# EAGLE schematic M7106C (EAGLE 6.6.0)

## Sheet 1 of 4
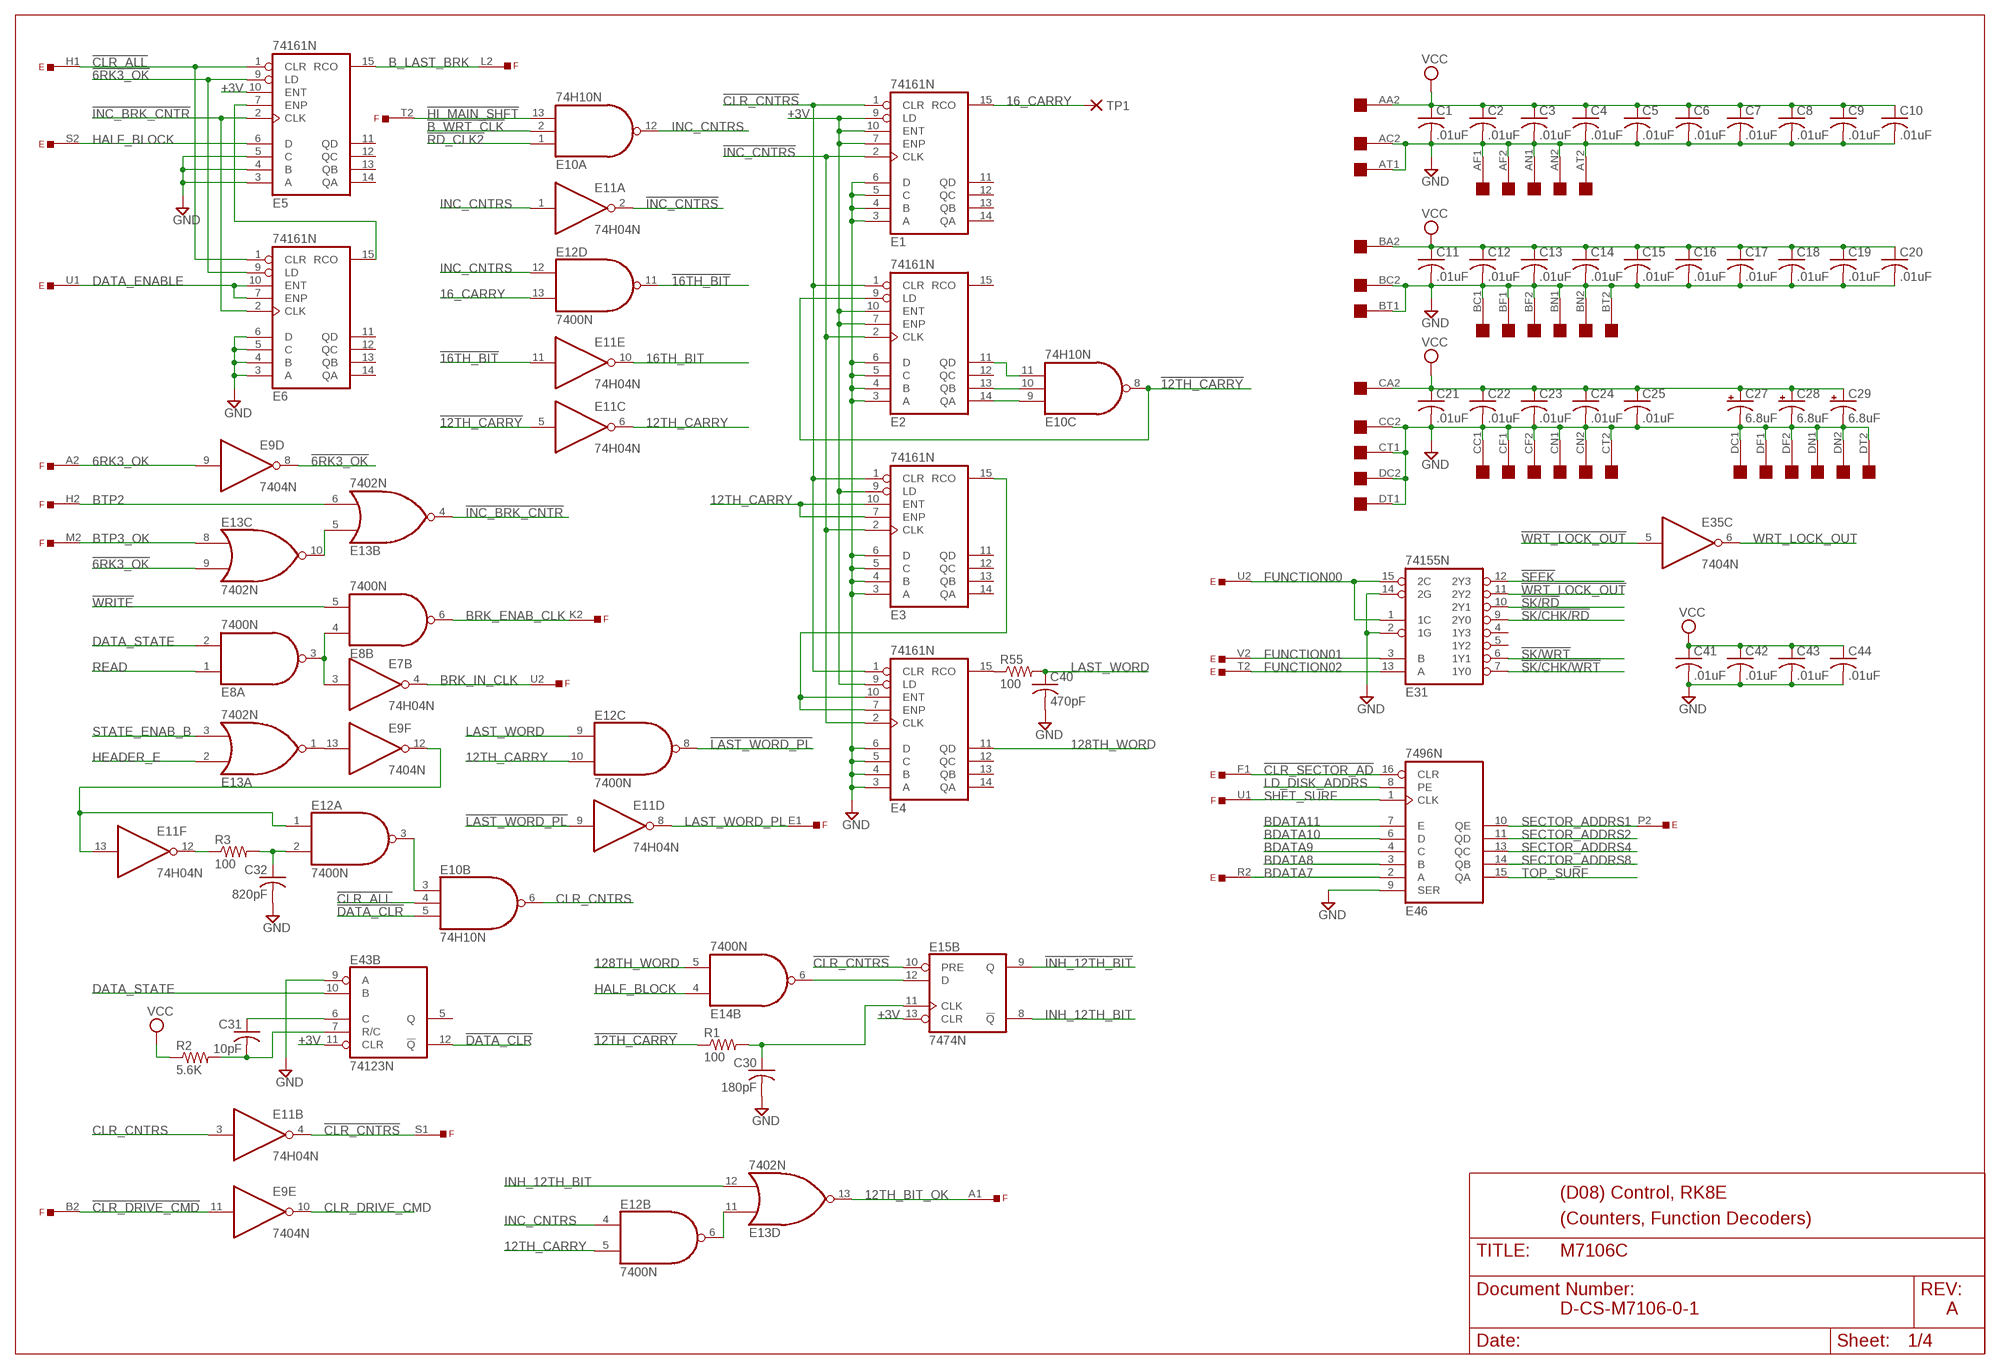
[diagram p0: schematic, sheet 1]

### Parts
C1  .01uF  C-US  [C063-025X075]
C2  .01uF  C-US  [C063-025X075]
C3  .01uF  C-US  [C063-025X075]
C4  .01uF  C-US  [C063-025X075]
C5  .01uF  C-US  [C063-025X075]
C6  .01uF  C-US  [C063-025X075]
C7  .01uF  C-US  [C063-025X075]
C8  .01uF  C-US  [C063-025X075]
C9  .01uF  C-US  [C063-025X075]
C10  .01uF  C-US  [C063-025X075]
C11  .01uF  C-US  [C063-025X075]
C12  .01uF  C-US  [C063-025X075]
C13  .01uF  C-US  [C063-025X075]
C14  .01uF  C-US  [C063-025X075]
C15  .01uF  C-US  [C063-025X075]
C16  .01uF  C-US  [C063-025X075]
C17  .01uF  C-US  [C063-025X075]
C18  .01uF  C-US  [C063-025X075]
C19  .01uF  C-US  [C063-025X075]
C20  .01uF  C-US  [C063-025X075]
C21  .01uF  C-US  [C063-025X075]
C22  .01uF  C-US  [C063-025X075]
C23  .01uF  C-US  [C063-025X075]
C24  .01uF  C-US  [C063-025X075]
C25  .01uF  C-US  [C063-025X075]
C27  6.8uF  CPOL-USE20-8AXIAL  [E12-8]
C28  6.8uF  CPOL-USE20-8AXIAL  [E12-8]
C29  6.8uF  CPOL-USE20-8AXIAL  [E12-8]
C30  180pF  C-US  [C063-025X075]
C31  10pF  C-US  [C063-025X075]
C32  820pF  C-US  [C063-025X075]
C40  470pF  C-US  [C063-025X075]
C41  .01uF  C-US  [C063-025X075]
C42  .01uF  C-US  [C063-025X075]
C43  .01uF  C-US  [C063-025X075]
C44  .01uF  C-US  [C063-025X075]
E  EDGE-TOP  [EDGE-CON2]
E1  74161N  [DIL16]
E2  74161N  [DIL16]
E3  74161N  [DIL16]
E4  74161N  [DIL16]
E5  74161N  [DIL16]
E6  74161N  [DIL16]
E7  74H04N  7404N  [DIL14]
E8  7400N  [DIL14]
E9  7404N  [DIL14]
E10  74H10N  7410N  [DIL14]
E11  74H04N  7404N  [DIL14]
E12  7400N  [DIL14]
E13  7402N  [DIL14]
E14  7400N  [DIL14]
E15  7474N  74S74N  [DIL14]
E31  74155N  [DIL16]
E35  7404N  [DIL14]
E43  74123N  [DIL16]
E46  7496N  74LS96N  [DIL16]
F  EDGE-TOP  [EDGE-CON2]
OMNIBUS  QUAD  [EDGE-CON8]
R1  100  R-US_0207/10  [0207/10]
R2  5.6K  R-US_0207/10  [0207/10]
R3  100  R-US_0207/10  [0207/10]
R55  100  R-US_0207/10  [0207/10]
TP1  PAD-0420  [0420]

### Nets
6RK3_OK: E9.9(D:I) F.A2 ; also sheet 3,4
12TH_BIT_OK: E13.13(D:O) F.A1
12TH_CARRY: E3.7(ENP) E3.10(ENT) E11.6(C:O) E12.5(B:I1) E12.10(C:I1)
16_CARRY: E1.15(RCO) E12.13(D:I1) TP1.P$1(P)
16TH_BIT: E11.10(E:O) ; also sheet 3
128TH_WORD: E4.11(QD) E14.5(B:I1)
!6RK3_OK: E5.9(LD) E6.9(LD) E9.8(D:O) E13.9(C:I1)
!12TH_CARRY: E2.9(LD) E10.8(C:O) E11.5(C:I) R1.1
!16TH_BIT: E11.11(E:I) E12.11(D:O) ; also sheet 3
!B_WRT_CLK: E10.2(A:I1) ; also sheet 2
!CLR_ALL: E5.1(CLR) E6.1(CLR) E10.4(B:I1) E.H1 ; also sheet 2,3
!CLR_CNTRS: E1.1(CLR) E2.1(CLR) E3.1(CLR) E4.1(CLR) E11.4(B:O) E15.10(B:PRE) F.S1
!CLR_DRIVE_CMD: E9.11(E:I) F.B2 ; also sheet 3
!CLR_SECTOR_AD: E46.16(CLR) E.F1
!DATA_CLR: E10.5(B:I2) E43.12(B:!Q)
!HI_MAIN_SHFT: E10.13(A:I2) F.T2
!INC_BRK_CNTR: E5.2(CLK) E6.2(CLK) E13.4(B:O)
!INC_CNTRS: E1.2(CLK) E2.2(CLK) E3.2(CLK) E4.2(CLK) E11.2(A:O)
!INH_12TH_BIT: E15.9(B:Q) ; also sheet 2
!LAST_WORD_PL: E11.9(D:I) E12.8(C:O) ; also sheet 3
!RD_CLK2: E10.1(A:I0) ; also sheet 2
!SEEK: E31.12(2Y3) ; also sheet 3
!SK/CHK/RD: E31.9(2Y0) ; also sheet 3
!SK/CHK/WRT: E31.7(1Y0) ; also sheet 2,3
!SK/RD: E31.10(2Y1) ; also sheet 3
!SK/WRT: E31.6(1Y1) ; also sheet 2,3
!WRITE: E8.5(B:I1) ; also sheet 2
!WRT_LOCK_OUT: E31.11(2Y2) E35.5(C:I) ; also sheet 3
+3V: E1.7(ENP) E1.9(LD) E1.10(ENT) E2.7(ENP) E2.10(ENT) E3.9(LD) E4.9(LD) E5.10(ENT) E15.13(B:CLR) E43.11(B:CLR) ; also sheet 2,3,4
B_LAST_BRK: E5.15(RCO) F.L2
BDATA7: E46.2(A) E.R2
BDATA8: E46.3(B) ; also sheet 4
BDATA9: E46.4(C) ; also sheet 4
BDATA10: E46.6(D) ; also sheet 4
BDATA11: E46.7(E) ; also sheet 4
BRK_ENAB_CLK: E8.6(B:O) F.K2
BRK_IN_CLK: E7.4(B:O) F.U2
BTP2: E13.6(B:I1) F.H2
BTP3_OK: E13.8(C:I0) F.M2
CLR_CNTRS: E10.6(B:O) E11.3(B:I)
CLR_DRIVE_CMD: E9.10(E:O) ; also sheet 3
DATA_ENABLE: E6.7(ENP) E6.10(ENT) E.U1
DATA_STATE: E8.2(A:I1) E43.10(B:B) ; also sheet 2,3
FUNCTION00: E31.1(1C) E31.15(2C) E.U2
FUNCTION01: E31.3(B) E.V2
FUNCTION02: E31.13(A) E.T2
GND [supply]: C1.2 C2.2 C3.2 C4.2 C5.2 C6.2 C7.2 C8.2 C9.2 C10.2 C11.2 C12.2 C13.2 C14.2 C15.2 C16.2 C17.2 C18.2 C19.2 C20.2 C21.2 C22.2 C23.2 C24.2 C25.2 C27.- C28.- C29.- C30.2 C32.2 C40.2 C41.2 C42.2 C43.2 C44.2 E1.3(A) E1.4(B) E1.5(C) E1.6(D) E2.3(A) E2.4(B) E2.5(C) E2.6(D) E3.3(A) E3.4(B) E3.5(C) E3.6(D) E4.3(A) E4.4(B) E4.5(C) E4.6(D) E5.3(A) E5.4(B) E5.5(C) E6.3(A) E6.4(B) E6.5(C) E6.6(D) E31.2(1G) E31.14(2G) E43.9(B:A) E46.9(SER) OMNIBUS.AC2 OMNIBUS.AF1 OMNIBUS.AF2 OMNIBUS.AN1 OMNIBUS.AN2 OMNIBUS.AT1 OMNIBUS.AT2 OMNIBUS.BC1 OMNIBUS.BC2 OMNIBUS.BF1 OMNIBUS.BF2 OMNIBUS.BN1 OMNIBUS.BN2 OMNIBUS.BT1 OMNIBUS.BT2 OMNIBUS.CC1 OMNIBUS.CC2 OMNIBUS.CF1 OMNIBUS.CF2 OMNIBUS.CN1 OMNIBUS.CN2 OMNIBUS.CT1 OMNIBUS.CT2 OMNIBUS.DC1 OMNIBUS.DC2 OMNIBUS.DF1 OMNIBUS.DF2 OMNIBUS.DN1 OMNIBUS.DN2 OMNIBUS.DT1 OMNIBUS.DT2 ; also sheet 2,3,4
HALF_BLOCK: E5.6(D) E14.4(B:I0) E.S2
HEADER_E: E13.2(A:I0) ; also sheet 3
INC_CNTRS: E10.12(A:O) E11.1(A:I) E12.4(B:I0) E12.12(D:I0)
INH_12TH_BIT: E13.12(D:I1) E15.8(B:!Q)
LAST_WORD: C40.1 E12.9(C:I0) R55.2
LAST_WORD_PL: E11.8(D:O) F.E1
LD_DISK_ADDRS: E46.8(PE) ; also sheet 3
N$1: E5.7(ENP) E6.15(RCO)
N$2: E9.13(F:I) E13.1(A:O)
N$3: E13.5(B:I0) E13.10(C:O)
N$4: E7.3(B:I) E8.3(A:O) E8.4(B:I0)
N$5: E9.12(F:O) E11.13(F:I) E12.1(A:I0)
N$6: E11.12(F:O) R3.1
N$7: C32.1 E12.2(A:I1) R3.2
N$8: C31.2 E43.7(B:R/C) R2.2
N$9: C31.1 E43.6(B:C)
N$10: E10.3(B:I0) E12.3(A:O)
N$11: E2.14(QA) E10.9(C:I0)
N$13: E2.13(QB) E10.10(C:I1)
N$14: E2.11(QD) E10.11(C:I2)
N$15: E3.15(RCO) E4.7(ENP) E4.10(ENT)
N$16: E4.15(RCO) R55.1
N$17: E14.6(B:O) E15.12(B:D)
N$18: C30.1 E15.11(B:CLK) R1.2
N$19: E12.6(B:O) E13.11(D:I0)
READ: E8.1(A:I0) ; also sheet 2,4
SECTOR_ADDRS1: E46.10(QE) E.P2 ; also sheet 4
SECTOR_ADDRS2: E46.11(QD) ; also sheet 4
SECTOR_ADDRS4: E46.13(QC) ; also sheet 4
SECTOR_ADDRS8: E46.14(QB) ; also sheet 4
SHFT_SURF: E46.1(CLK) F.U1
STATE_ENAB_B: E13.3(A:I1) ; also sheet 2
TOP_SURF: E46.15(QA) ; also sheet 4
VCC [supply]: C1.1 C2.1 C3.1 C4.1 C5.1 C6.1 C7.1 C8.1 C9.1 C10.1 C11.1 C12.1 C13.1 C14.1 C15.1 C16.1 C17.1 C18.1 C19.1 C20.1 C21.1 C22.1 C23.1 C24.1 C25.1 C27.+ C28.+ C29.+ C41.1 C42.1 C43.1 C44.1 OMNIBUS.AA2 OMNIBUS.BA2 OMNIBUS.CA2 R2.1 ; also sheet 2,3,4
WRT_LOCK_OUT: E35.6(C:O) ; also sheet 4
Unconnected: E1.11(QD) E1.12(QC) E1.13(QB) E1.14(QA) E2.12(QC) E2.15(RCO) E3.11(QD) E3.12(QC) E3.13(QB) E3.14(QA) E4.12(QC) E4.13(QB) E4.14(QA) E5.11(QD) E5.12(QC) E5.13(QB) E5.14(QA) E6.11(QD) E6.12(QC) E6.13(QB) E6.14(QA) E7.1(A:I) E7.2(A:O) E31.4(1Y3) E31.5(1Y2) E35.8(D:O) E35.9(D:I) E43.5(B:Q) F.T1 OMNIBUS.AA1 OMNIBUS.AB1 OMNIBUS.AB2 OMNIBUS.AC1 OMNIBUS.AD2 OMNIBUS.AE2 OMNIBUS.AH1 OMNIBUS.AH2 OMNIBUS.AJ2 OMNIBUS.AK2 OMNIBUS.AL2 OMNIBUS.AM2 OMNIBUS.AP1 OMNIBUS.AP2 OMNIBUS.AR1 OMNIBUS.AR2 OMNIBUS.AS1 OMNIBUS.AS2 OMNIBUS.AU1 OMNIBUS.AU2 OMNIBUS.AV1 OMNIBUS.AV2 OMNIBUS.BA1 OMNIBUS.BB1 OMNIBUS.BB2 OMNIBUS.BD1 OMNIBUS.BD2 OMNIBUS.BE1 OMNIBUS.BE2 OMNIBUS.BH1 OMNIBUS.BH2 OMNIBUS.BJ1 OMNIBUS.BJ2 OMNIBUS.BK1 OMNIBUS.BK2 OMNIBUS.BL1 OMNIBUS.BL2 OMNIBUS.BM1 OMNIBUS.BM2 OMNIBUS.BP1 OMNIBUS.BP2 OMNIBUS.BR1 OMNIBUS.BR2 OMNIBUS.BS1 OMNIBUS.BS2 OMNIBUS.BU1 OMNIBUS.BU2 OMNIBUS.BV1 OMNIBUS.CA1 OMNIBUS.CB1 OMNIBUS.CB2 OMNIBUS.CD1 OMNIBUS.CD2 OMNIBUS.CE1 OMNIBUS.CE2 OMNIBUS.CH1 OMNIBUS.CH2 OMNIBUS.CJ1 OMNIBUS.CJ2 OMNIBUS.CK1 OMNIBUS.CK2 OMNIBUS.CL1 OMNIBUS.CL2 OMNIBUS.CM1 OMNIBUS.CM2 OMNIBUS.CP1 OMNIBUS.CP2 OMNIBUS.CR2 OMNIBUS.CS2 OMNIBUS.CU1 OMNIBUS.CU2 OMNIBUS.CV1 OMNIBUS.CV2 OMNIBUS.DA2 OMNIBUS.DB2 OMNIBUS.DD1 OMNIBUS.DD2 OMNIBUS.DE1 OMNIBUS.DE2 OMNIBUS.DH2 OMNIBUS.DJ2 OMNIBUS.DK2 OMNIBUS.DL2 OMNIBUS.DM2 OMNIBUS.DP2 OMNIBUS.DR2 OMNIBUS.DS2 OMNIBUS.DU2 OMNIBUS.DV2

### Notes on the sheet
- (D08) Control, RK8E
- (Counters, Function Decoders)
- D-CS-M7106-0-1 | A

## Sheet 2 of 4
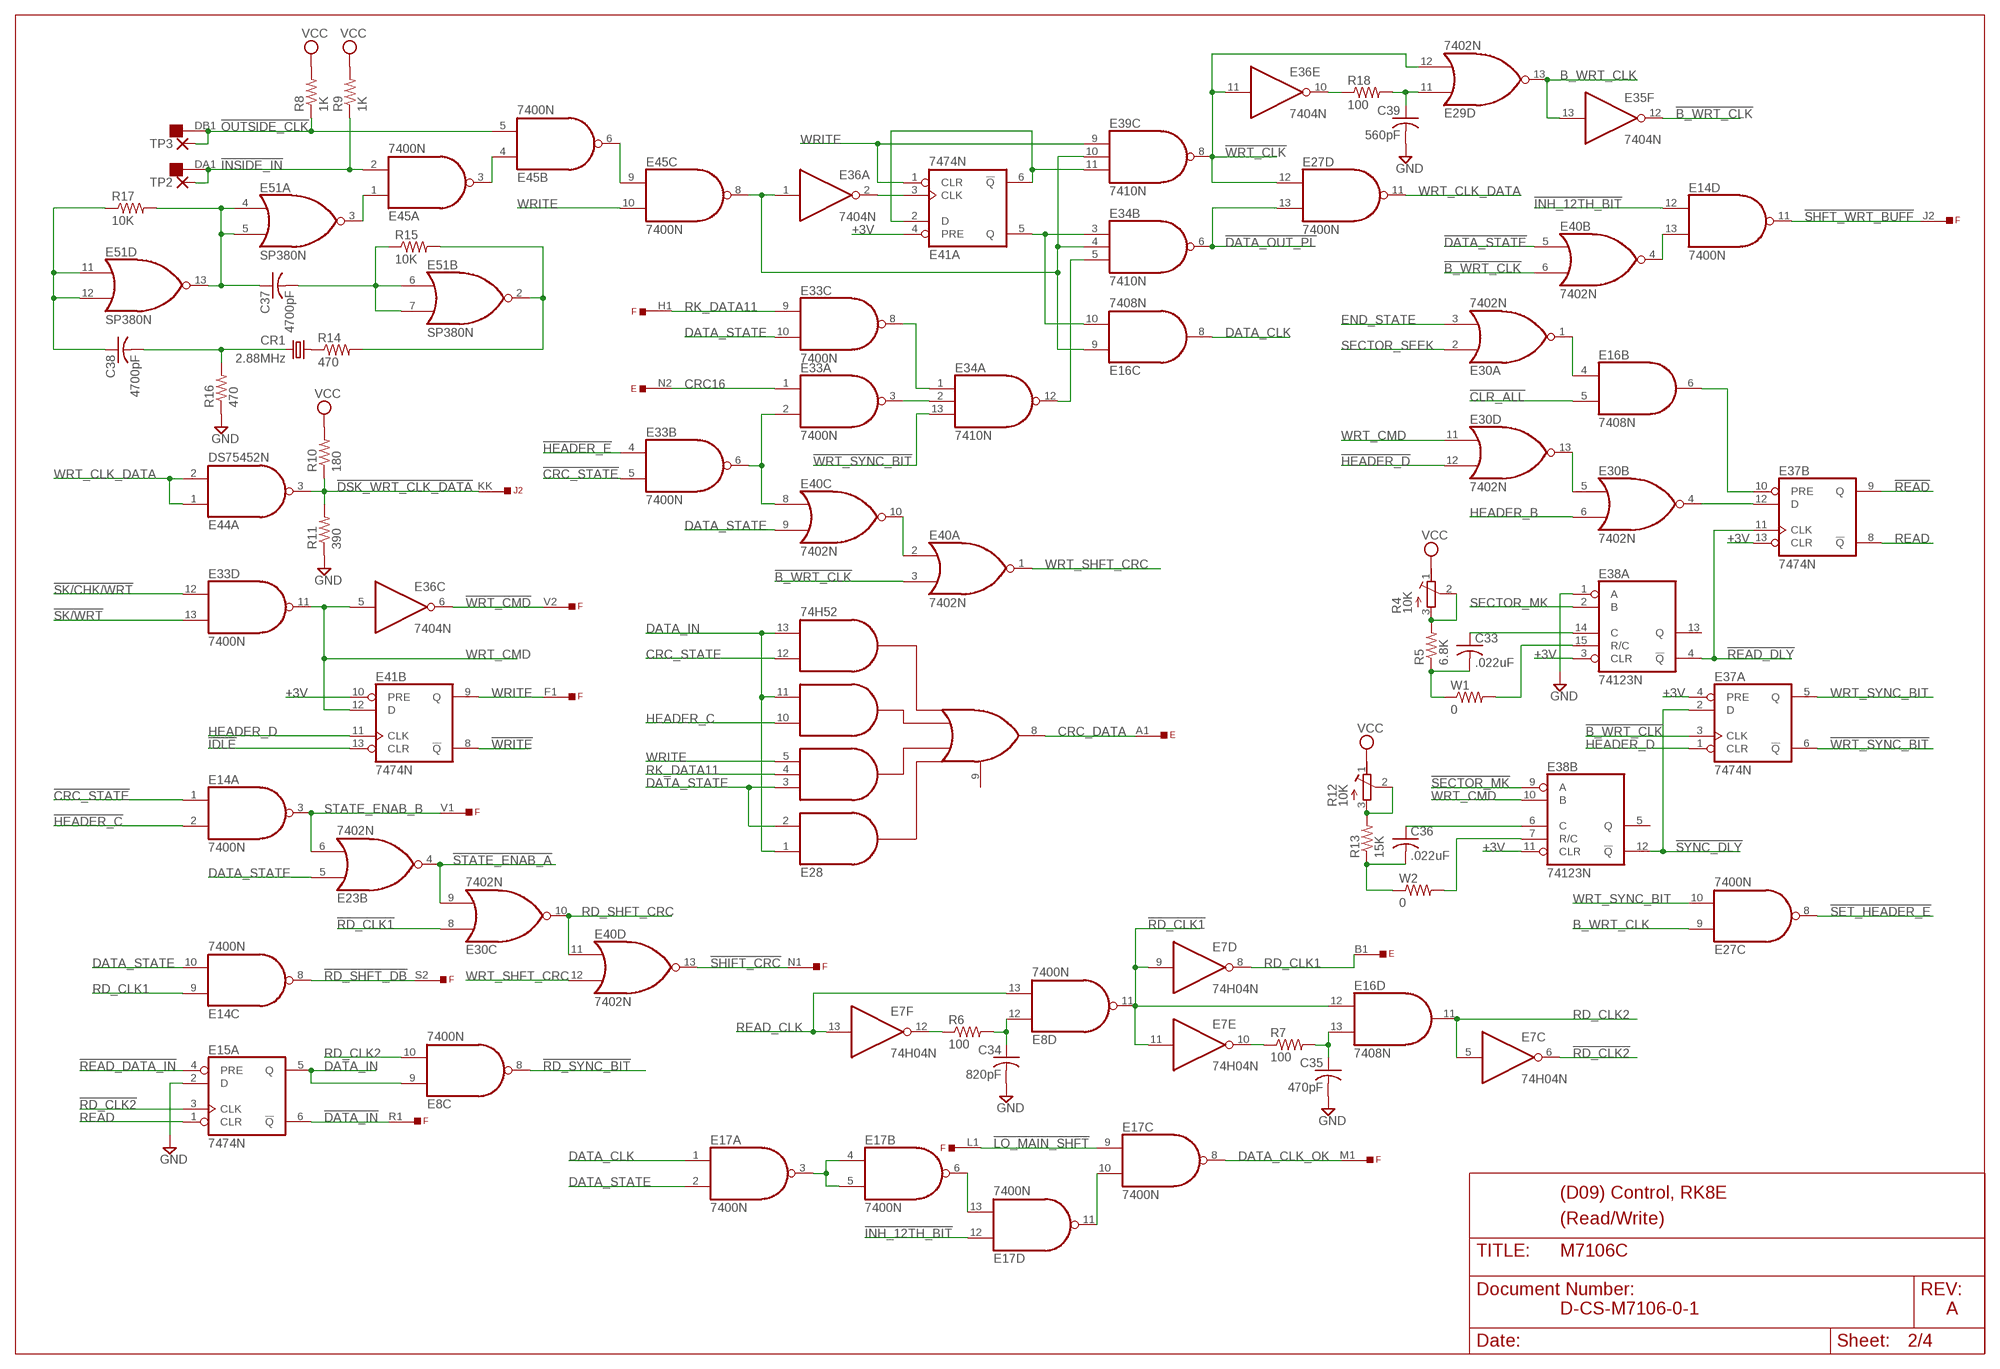
[diagram p1: schematic, sheet 2]

### Parts
C33  .022uF  C-US8  [C203-054-229]
C34  820pF  C-US  [C063-025X075]
C35  470pF  C-US  [C063-025X075]
C36  .022uF  C-US8  [C203-054-229]
C37  4700pF  C-US8  [C203-054-229]
C38  4700pF  C-US8  [C203-054-229]
C39  560pF  C-US  [C063-025X075]
CR1  2.88MHz  CRYSTALHC49TL-H  [HC49TL-H]
E16  7408N  74S08N  [DIL14]
E17  7400N  [DIL14]
E23  7402N  [DIL14]
E27  7400N  [DIL14]
E28  74H52  [DIL14]
E29  7402N  [DIL14]
E30  7402N  [DIL14]
E33  7400N  [DIL14]
E34  7410N  [DIL14]
E36  7404N  [DIL14]
E37  7474N  74S74N  [DIL14]
E38  74123N  [DIL16]
E39  7410N  [DIL14]
E40  7402N  [DIL14]
E41  7474N  74S74N  [DIL14]
E44  DS75452N  [DIL08]
E45  7400N  [DIL14]
E51  SP380N  [DIL14]
J2  DEC40PINSH  [DEC40PINH]
R4  10K  275P  [3006Y]
R5  6.8K  R-US_0207/10  [0207/10]
R6  100  R-US_0207/10  [0207/10]
R7  100  R-US_0207/10  [0207/10]
R8  1K  R-US_0207/10  [0207/10]
R9  1K  R-US_0207/10  [0207/10]
R10  180  R-US_0207/10  [0207/10]
R11  390  R-US_0207/10  [0207/10]
R12  10K  275P  [3006Y]
R13  15K  R-US_0207/10  [0207/10]
R14  470  R-US_0207/10  [0207/10]
R15  10K  R-US_0207/10  [0207/10]
R16  470  R-US_0207/10  [0207/10]
R17  10K  R-US_0207/10  [0207/10]
R18  100  R-US_0207/10  [0207/10]
TP2  PAD-0420  [0420]
TP3  PAD-0420  [0420]
W1  0  R-US_0207/10  [0207/10]
W2  0  R-US_0207/10  [0207/10]

### Nets
!B_WRT_CLK: E35.12(F:O) E37.3(A:CLK) E40.3(A:I1) E40.6(B:I1) ; also sheet 1
!CLR_ALL: E16.5(B:I1) ; also sheet 1,3
!CRC_STATE: E14.1(A:I0) E33.5(B:I1) ; also sheet 3
!DATA_IN: E15.6(A:!Q) F.R1
!DATA_OUT_PL: E27.13(D:I1) E34.6(B:O)
!DATA_STATE: E40.5(B:I0) ; also sheet 3
!DSK_WRT_CLK_DATA: E44.3(A:O) J2.KK R10.1 R11.2
!HEADER_C: E14.2(A:I1) ; also sheet 3
!HEADER_D: E30.12(D:I1) ; also sheet 3
!HEADER_E: E33.4(B:I0) ; also sheet 3
!IDLE: E41.13(B:CLR) ; also sheet 3,4
!INH_12TH_BIT: E14.12(D:I0) E17.12(D:I0) ; also sheet 1
!INSIDE_IN: E45.2(A:I1) OMNIBUS.DA1 R9.1 TP2.P$1(P)
!LO_MAIN_SHFT: E17.9(C:I0) F.L1
!OUTSIDE_CLK: E45.5(B:I1) OMNIBUS.DB1 R8.1 TP3.P$1(P)
!RD_CLK1: E7.9(D:I) E7.11(E:I) E8.11(D:O) E16.12(D:I0) E30.8(C:I0)
!RD_CLK2: E7.6(C:O) E15.3(A:CLK) ; also sheet 1
!RD_SHFT_DB: E14.8(C:O) F.S2
!RD_SYNC_BIT: E8.8(C:O) ; also sheet 3
!READ: E37.9(B:Q) ; also sheet 4
!READ_DATA_IN: E15.4(A:PRE) ; also sheet 4
!READ_DLY: E37.11(B:CLK) E38.4(A:!Q)
!SECTOR_MK: E38.9(B:A) ; also sheet 3,4
!SET_HEADER_E: E27.8(C:O) ; also sheet 3
!SHFT_WRT_BUFF: E14.11(D:O) F.J2
!SHIFT_CRC: E40.13(D:O) F.N1
!SK/CHK/WRT: E33.12(D:I0) ; also sheet 1,3
!SK/WRT: E33.13(D:I1) ; also sheet 1,3
!STATE_ENAB_A: E23.4(B:O) E30.9(C:I1)
!SYNC_DLY: E37.2(A:D) E38.12(B:!Q)
!WRITE: E41.8(B:!Q) ; also sheet 1
!WRT_CLK: E27.12(D:I0) E29.12(D:I1) E36.11(E:I) E39.8(C:O)
!WRT_CMD: E36.6(C:O) F.V2 ; also sheet 3,4
!WRT_SYNC_BIT: E34.13(A:I2) E37.6(A:!Q)
+3V: E37.4(A:PRE) E37.13(B:CLR) E38.3(A:CLR) E38.11(B:CLR) E41.4(A:PRE) E41.10(B:PRE) ; also sheet 1,3,4
B_WRT_CLK: E27.9(C:I0) E29.13(D:O) E35.13(F:I)
CRC16: E33.1(A:I0) E.N2
CRC_DATA: E28.8(O8) E.A1
CRC_STATE: E28.12(I12) ; also sheet 3
DATA_CLK: E16.8(C:O) E17.1(A:I0)
DATA_CLK_OK: E17.8(C:O) F.M1
DATA_IN: E8.9(C:I0) E15.5(A:Q) E28.1(I1) E28.11(I11) E28.13(I13)
DATA_STATE: E14.10(C:I1) E17.2(A:I1) E23.5(B:I0) E28.2(I2) E28.3(I3) E33.10(C:I1) E40.9(C:I1) ; also sheet 1,3
END_STATE: E30.3(A:I1) ; also sheet 3
GND [supply]: C34.2 C35.2 C39.2 E15.2(A:D) E38.1(A:A) R11.1 R16.1 ; also sheet 1,3,4
HEADER_B: E30.6(B:I1) ; also sheet 3
HEADER_C: E28.10(I10) ; also sheet 3
HEADER_D: E37.1(A:CLR) E41.11(B:CLK) ; also sheet 3
N$12: E39.11(C:I2) E41.2(A:D) E41.6(A:!Q)
N$20: C37.1 E51.4(A:I0) E51.5(A:I1) E51.13(D:O) R17.2
N$21: C38.1 E51.11(D:I0) E51.12(D:I1) R17.1
N$22: C38.2 CR1.2 R16.2
N$23: CR1.1 R14.1
N$24: C37.2 E51.6(B:I0) E51.7(B:I1) R15.1
N$25: E51.2(B:O) R14.2 R15.2
N$26: E45.1(A:I0) E51.3(A:O)
N$27: E45.6(B:O) E45.9(C:I0)
N$28: E45.3(A:O) E45.4(B:I0)
N$29: E16.9(C:I0) E34.4(B:I1) E36.1(A:I) E39.10(C:I1) E45.8(C:O)
N$30: E36.2(A:O) E41.3(A:CLK)
N$31: E16.10(C:I1) E34.3(B:I0) E41.5(A:Q)
N$32: E33.8(C:O) E34.1(A:I0)
N$35: E33.3(A:O) E34.2(A:I1)
N$36: C39.1 E29.11(D:I0) R18.2
N$37: E33.2(A:I1) E33.6(B:O) E40.8(C:I0)
N$38: E40.2(A:I0) E40.10(C:O)
N$39: E34.5(B:I2) E34.12(A:O)
N$40: E36.10(E:O) R18.1
N$41: E17.6(B:O) E17.13(D:I1)
N$42: E14.13(D:I1) E40.4(B:O)
N$43: E17.10(C:I1) E17.11(D:O)
N$44: E17.3(A:O) E17.4(B:I0) E17.5(B:I1)
N$45: E30.5(B:I0) E30.13(D:O)
N$46: E30.4(B:O) E37.12(B:D)
N$47: R4.2(S) R4.3(E) R5.2
N$48: C33.2 R5.1 W1.1
N$49: C33.1 E38.14(A:C)
N$50: R12.2(S) R12.3(E) R13.2
N$51: E16.4(B:I0) E30.1(A:O)
N$52: C36.1 E38.6(B:C)
N$53: E38.7(B:R/C) W2.2
N$54: E16.6(B:O) E37.10(B:PRE)
N$55: C36.2 R13.1 W2.1
N$56: E7.12(F:O) R6.1
N$57: C34.1 E8.12(D:I0) R6.2
N$59: E7.10(E:O) R7.1
N$60: C35.1 E16.13(D:I1) R7.2
N$90: E38.15(A:R/C) W1.2
RD_CLK1: E7.8(D:O) E14.9(C:I0) E.B1
RD_CLK2: E7.5(C:I) E8.10(C:I1) E16.11(D:O)
RD_SHFT_CRC: E30.10(C:O) E40.11(D:I0)
READ: E15.1(A:CLR) E37.8(B:!Q) ; also sheet 1,4
READ_CLK: E7.13(F:I) E8.13(D:I1) ; also sheet 4
RK_DATA11: E28.4(I4) E33.9(C:I0) F.H1
SECTOR_MK: E38.2(A:B) ; also sheet 3,4
SECTOR_SEEK: E30.2(A:I0) ; also sheet 3,4
STATE_ENAB_B: E14.3(A:O) E23.6(B:I1) F.V1 ; also sheet 1
VCC [supply]: R4.1(A) R8.2 R9.2 R10.2 R12.1(A) ; also sheet 1,3,4
WRITE: E28.5(I5) E39.9(C:I0) E41.1(A:CLR) E41.9(B:Q) E45.10(C:I1) F.F1 ; also sheet 4
WRT_CLK_DATA: E27.11(D:O) E44.1(A:I0) E44.2(A:I1)
WRT_CMD: E30.11(D:I0) E33.11(D:O) E36.5(C:I) E38.10(B:B) E41.12(B:D)
WRT_SHFT_CRC: E40.1(A:O) E40.12(D:I1)
WRT_SYNC_BIT: E27.10(C:I1) E37.5(A:Q)
Unconnected: E28.6(NC) E28.9(I9) E36.3(B:I) E36.4(B:O) E36.8(D:O) E36.9(D:I) E36.12(F:O) E36.13(F:I) E38.5(B:Q) E38.13(A:Q) E44.5(B:O) E44.6(B:I0) E44.7(B:I1) J2.A

### Notes on the sheet
- (D09) Control, RK8E
- (Read/Write)
- D-CS-M7106-0-1 | A

## Sheet 3 of 4
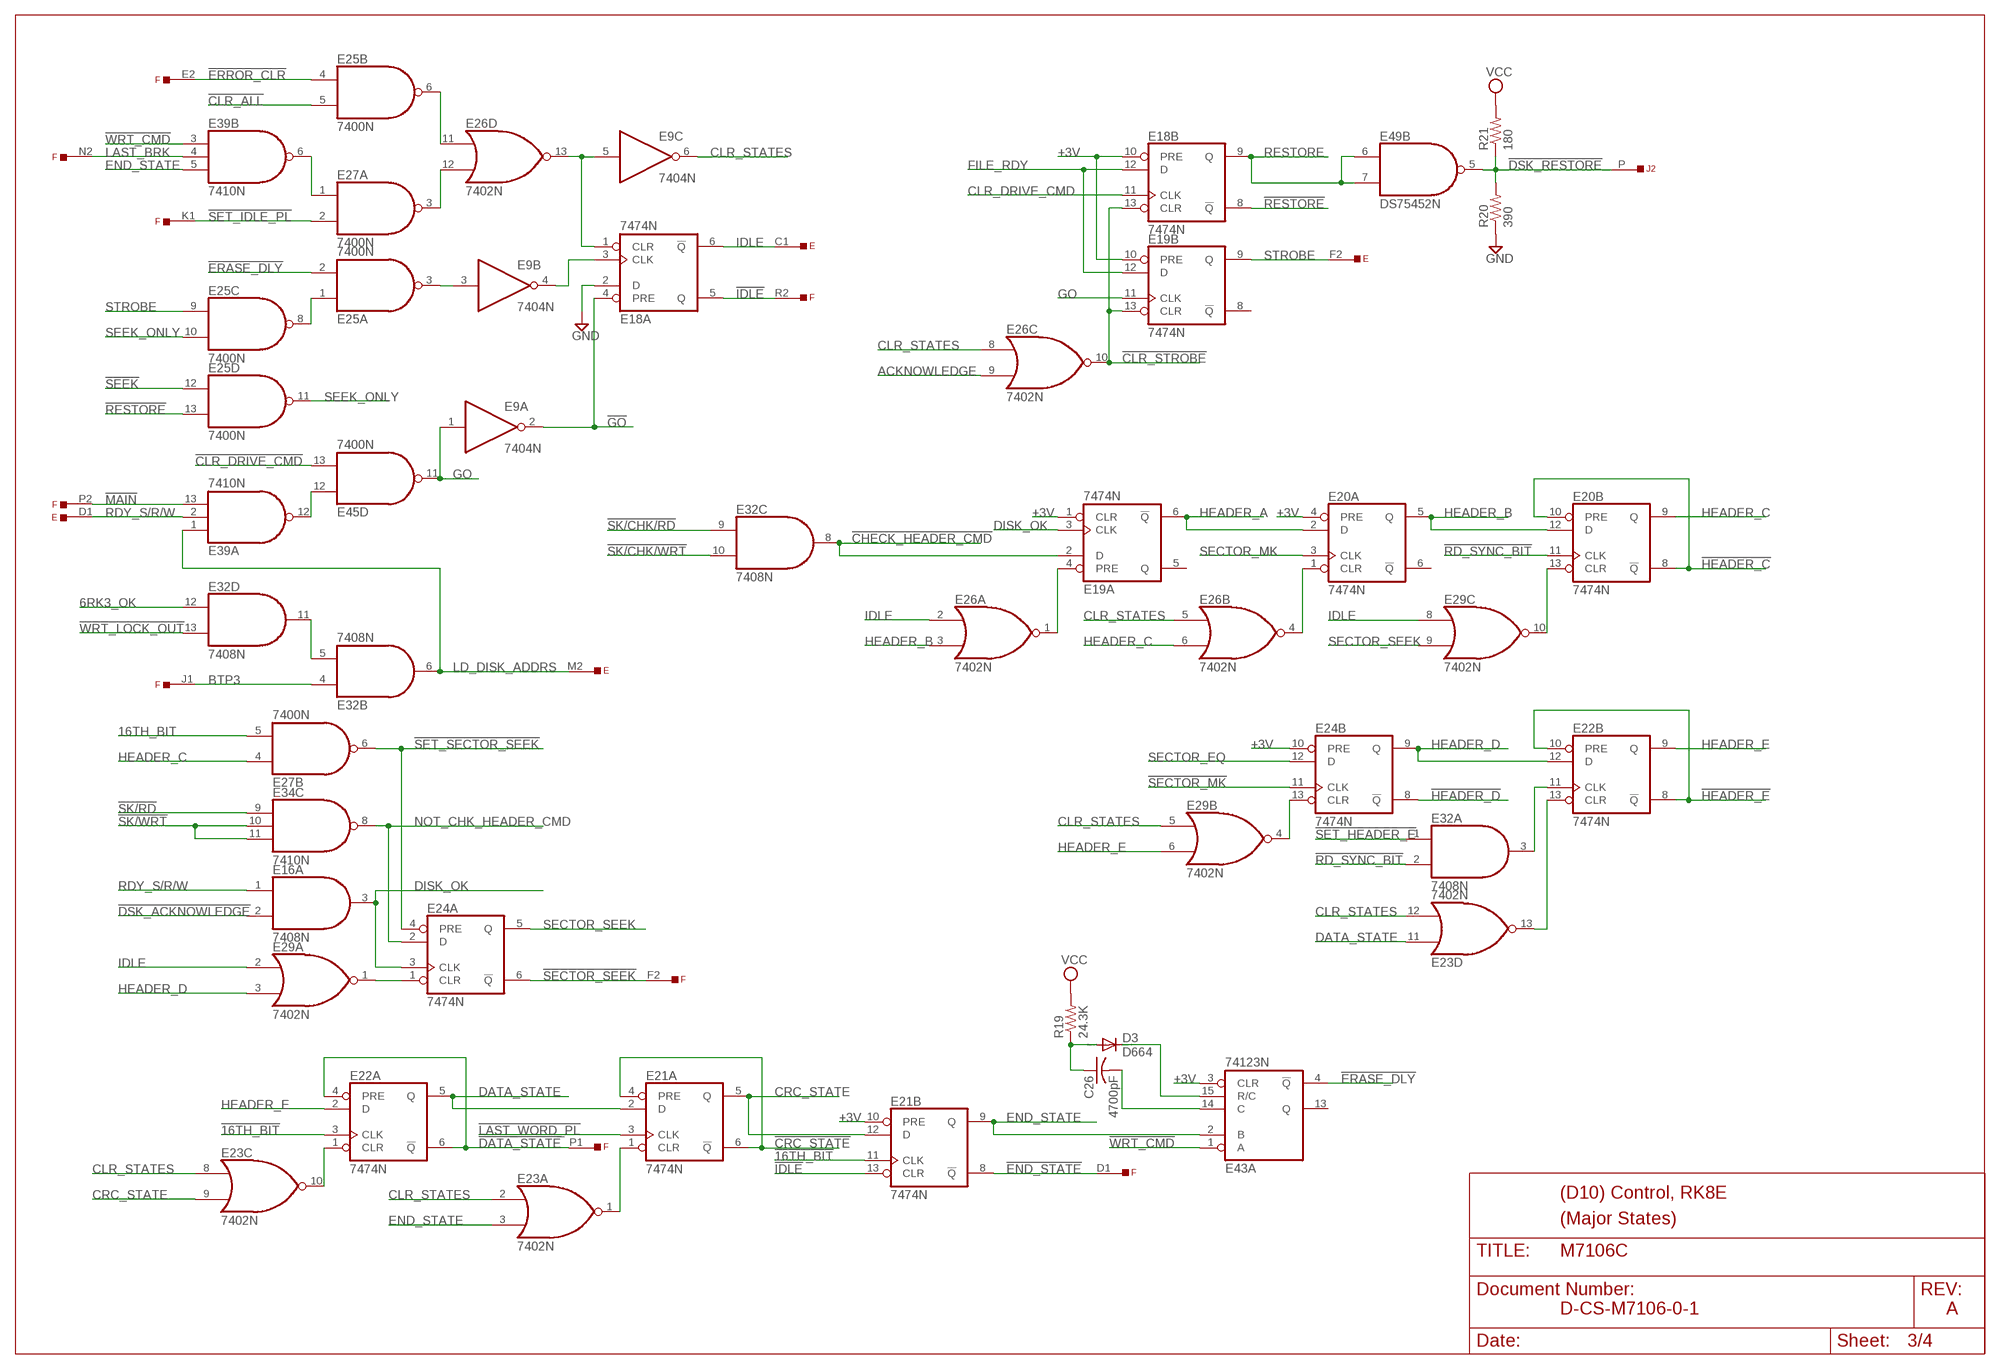
[diagram p2: schematic, sheet 3]

### Parts
C26  4700pF  C-US8  [C203-054-229]
D3  D664  DIODE-DO35-10  [DO35-10]
E18  7474N  74S74N  [DIL14]
E19  7474N  74S74N  [DIL14]
E20  7474N  74S74N  [DIL14]
E21  7474N  74S74N  [DIL14]
E22  7474N  74S74N  [DIL14]
E24  7474N  74S74N  [DIL14]
E25  7400N  74S00N  [DIL14]
E26  7402N  [DIL14]
E32  7408N  74S08N  [DIL14]
E49  DS75452N  [DIL08]
R19  24.3K  R-US_0207/15  [0207/15]
R20  390  R-US_0207/10  [0207/10]
R21  180  R-US_0207/10  [0207/10]

### Nets
6RK3_OK: E32.12(D:I0) ; also sheet 1,4
16TH_BIT: E27.5(B:I1) ; also sheet 1
!16TH_BIT: E21.11(B:CLK) E22.3(A:CLK) ; also sheet 1
!CHECK_HEADER_CMD: E19.2(A:D) E32.8(C:O)
!CLR_ALL: E25.5(B:I1) ; also sheet 1,2
!CLR_DRIVE_CMD: E45.13(D:I1) ; also sheet 1
!CLR_STROBE: E18.13(B:CLR) E19.13(B:CLR) E26.10(C:O)
!CRC_STATE: E21.4(A:PRE) E21.6(A:!Q) ; also sheet 2
!DATA_STATE: E22.4(A:PRE) E22.6(A:!Q) F.P1 ; also sheet 2
!DSK_ACKNOWLEDGE: E16.2(A:I1) ; also sheet 4
!DSK_RESTORE: E49.5(B:O) J2.P R20.2 R21.1
!END_STATE: E21.8(B:!Q) F.D1
!ERASE_DLY: E25.2(A:I1) E43.4(A:!Q)
!ERROR_CLR: E25.4(B:I0) F.E2
!GO: E9.2(A:O) E18.4(A:PRE)
!HEADER_C: E20.8(B:!Q) E20.10(B:PRE) ; also sheet 2
!HEADER_D: E24.8(B:!Q) ; also sheet 2
!HEADER_E: E22.8(B:!Q) E22.10(B:PRE) ; also sheet 2
!IDLE: E18.5(A:Q) E21.13(B:CLR) F.R2 ; also sheet 2,4
!LAST_WORD_PL: E21.3(A:CLK) ; also sheet 1
!MAIN: E39.13(A:I2) F.P2
!RD_SYNC_BIT: E20.11(B:CLK) E32.2(A:I1) ; also sheet 2
!RESTORE: E18.8(B:!Q) E25.13(D:I1)
!SECTOR_MK: E24.11(B:CLK) ; also sheet 2,4
!SECTOR_SEEK: E24.6(A:!Q) F.F2
!SEEK: E25.12(D:I0) ; also sheet 1
!SET_HEADER_E: E32.1(A:I0) ; also sheet 2
!SET_IDLE_PL: E27.2(A:I1) F.K1
!SET_SECTOR_SEEK: E24.4(A:PRE) E27.6(B:O)
!SK/CHK/RD: E32.9(C:I0) ; also sheet 1
!SK/CHK/WRT: E32.10(C:I1) ; also sheet 1,2
!SK/RD: E34.9(C:I0) ; also sheet 1
!SK/WRT: E34.10(C:I1) E34.11(C:I2) ; also sheet 1,2
!WRT_CMD: E39.3(B:I0) E43.1(A:A) ; also sheet 2,4
!WRT_LOCK_OUT: E32.13(D:I1) ; also sheet 1
+3V: E18.10(B:PRE) E19.1(A:CLR) E19.10(B:PRE) E20.4(A:PRE) E21.10(B:PRE) E24.10(B:PRE) E43.3(A:CLR) ; also sheet 1,2,4
ACKNOWLEDGE: E26.9(C:I1) ; also sheet 4
BTP3: E32.4(B:I0) F.J1
CLR_DRIVE_CMD: E18.11(B:CLK) ; also sheet 1
CLR_STATES: E9.6(C:O) E23.2(A:I0) E23.8(C:I0) E23.12(D:I1) E26.5(B:I0) E26.8(C:I0) E29.5(B:I0)
CRC_STATE: E21.5(A:Q) E21.12(B:D) E23.9(C:I1) ; also sheet 2
DATA_STATE: E21.2(A:D) E22.5(A:Q) E23.11(D:I0) ; also sheet 1,2
DISK_OK: E16.3(A:O) E19.3(A:CLK) E24.3(A:CLK)
END_STATE: E21.9(B:Q) E23.3(A:I1) E39.5(B:I2) E43.2(A:B) ; also sheet 2
FILE_RDY: E18.12(B:D) E19.12(B:D) ; also sheet 4
GND [supply]: E18.2(A:D) R20.1 ; also sheet 1,2,4
GO: E9.1(A:I) E19.11(B:CLK) E45.11(D:O)
HEADER_A: E19.6(A:!Q) E20.2(A:D)
HEADER_B: E20.5(A:Q) E20.12(B:D) E26.3(A:I1) ; also sheet 2
HEADER_C: E20.9(B:Q) E26.6(B:I1) E27.4(B:I0) ; also sheet 2
HEADER_D: E22.12(B:D) E24.9(B:Q) E29.3(A:I1) ; also sheet 2
HEADER_E: E22.2(A:D) E22.9(B:Q) E29.6(B:I1) ; also sheet 1
IDLE: E18.6(A:!Q) E26.2(A:I0) E29.2(A:I0) E29.8(C:I0) E.C1
LAST_BRK: E39.4(B:I1) F.N2
LD_DISK_ADDRS: E32.6(B:O) E39.1(A:I0) E.M2 ; also sheet 1
N$58: E27.1(A:I0) E39.6(B:O)
N$62: E25.6(B:O) E26.11(D:I0)
N$63: E26.12(D:I1) E27.3(A:O)
N$64: E9.5(C:I) E18.1(A:CLR) E26.13(D:O)
N$65: E32.5(B:I1) E32.11(D:O)
N$66: E9.4(B:O) E18.3(A:CLK)
N$67: E9.3(B:I) E25.3(A:O)
N$68: E25.1(A:I0) E25.8(C:O)
N$69: E39.12(A:O) E45.12(D:I0)
N$70: E24.1(A:CLR) E29.1(A:O)
N$71: E22.1(A:CLR) E23.10(C:O)
N$72: E21.1(A:CLR) E23.1(A:O)
N$73: C26.1 D3.A R19.1
N$74: C26.2 E43.14(A:C)
N$75: E19.4(A:PRE) E26.1(A:O)
N$76: D3.C E43.15(A:R/C)
N$77: E20.1(A:CLR) E26.4(B:O)
N$78: E20.13(B:CLR) E29.10(C:O)
N$79: E22.13(B:CLR) E23.13(D:O)
N$80: E22.11(B:CLK) E32.3(A:O)
N$81: E24.13(B:CLR) E29.4(B:O)
NOT_CHK_HEADER_CMD: E24.2(A:D) E34.8(C:O)
RDY_S/R/W: E16.1(A:I0) E39.2(A:I1) E.D1
RESTORE: E18.9(B:Q) E49.6(B:I0) E49.7(B:I1)
SECTOR_EQ: E24.12(B:D) ; also sheet 4
SECTOR_MK: E20.3(A:CLK) ; also sheet 2,4
SECTOR_SEEK: E24.5(A:Q) E29.9(C:I1) ; also sheet 2,4
SEEK_ONLY: E25.10(C:I1) E25.11(D:O)
STROBE: E19.9(B:Q) E25.9(C:I0) E.F2 ; also sheet 4
VCC [supply]: R19.2 R21.2 ; also sheet 1,2,4
Unconnected: E19.5(A:Q) E19.8(B:!Q) E20.6(A:!Q) E43.13(A:Q)

### Notes on the sheet
- (D10) Control, RK8E
- (Major States)
- D-CS-M7106-0-1 | A

## Sheet 4 of 4
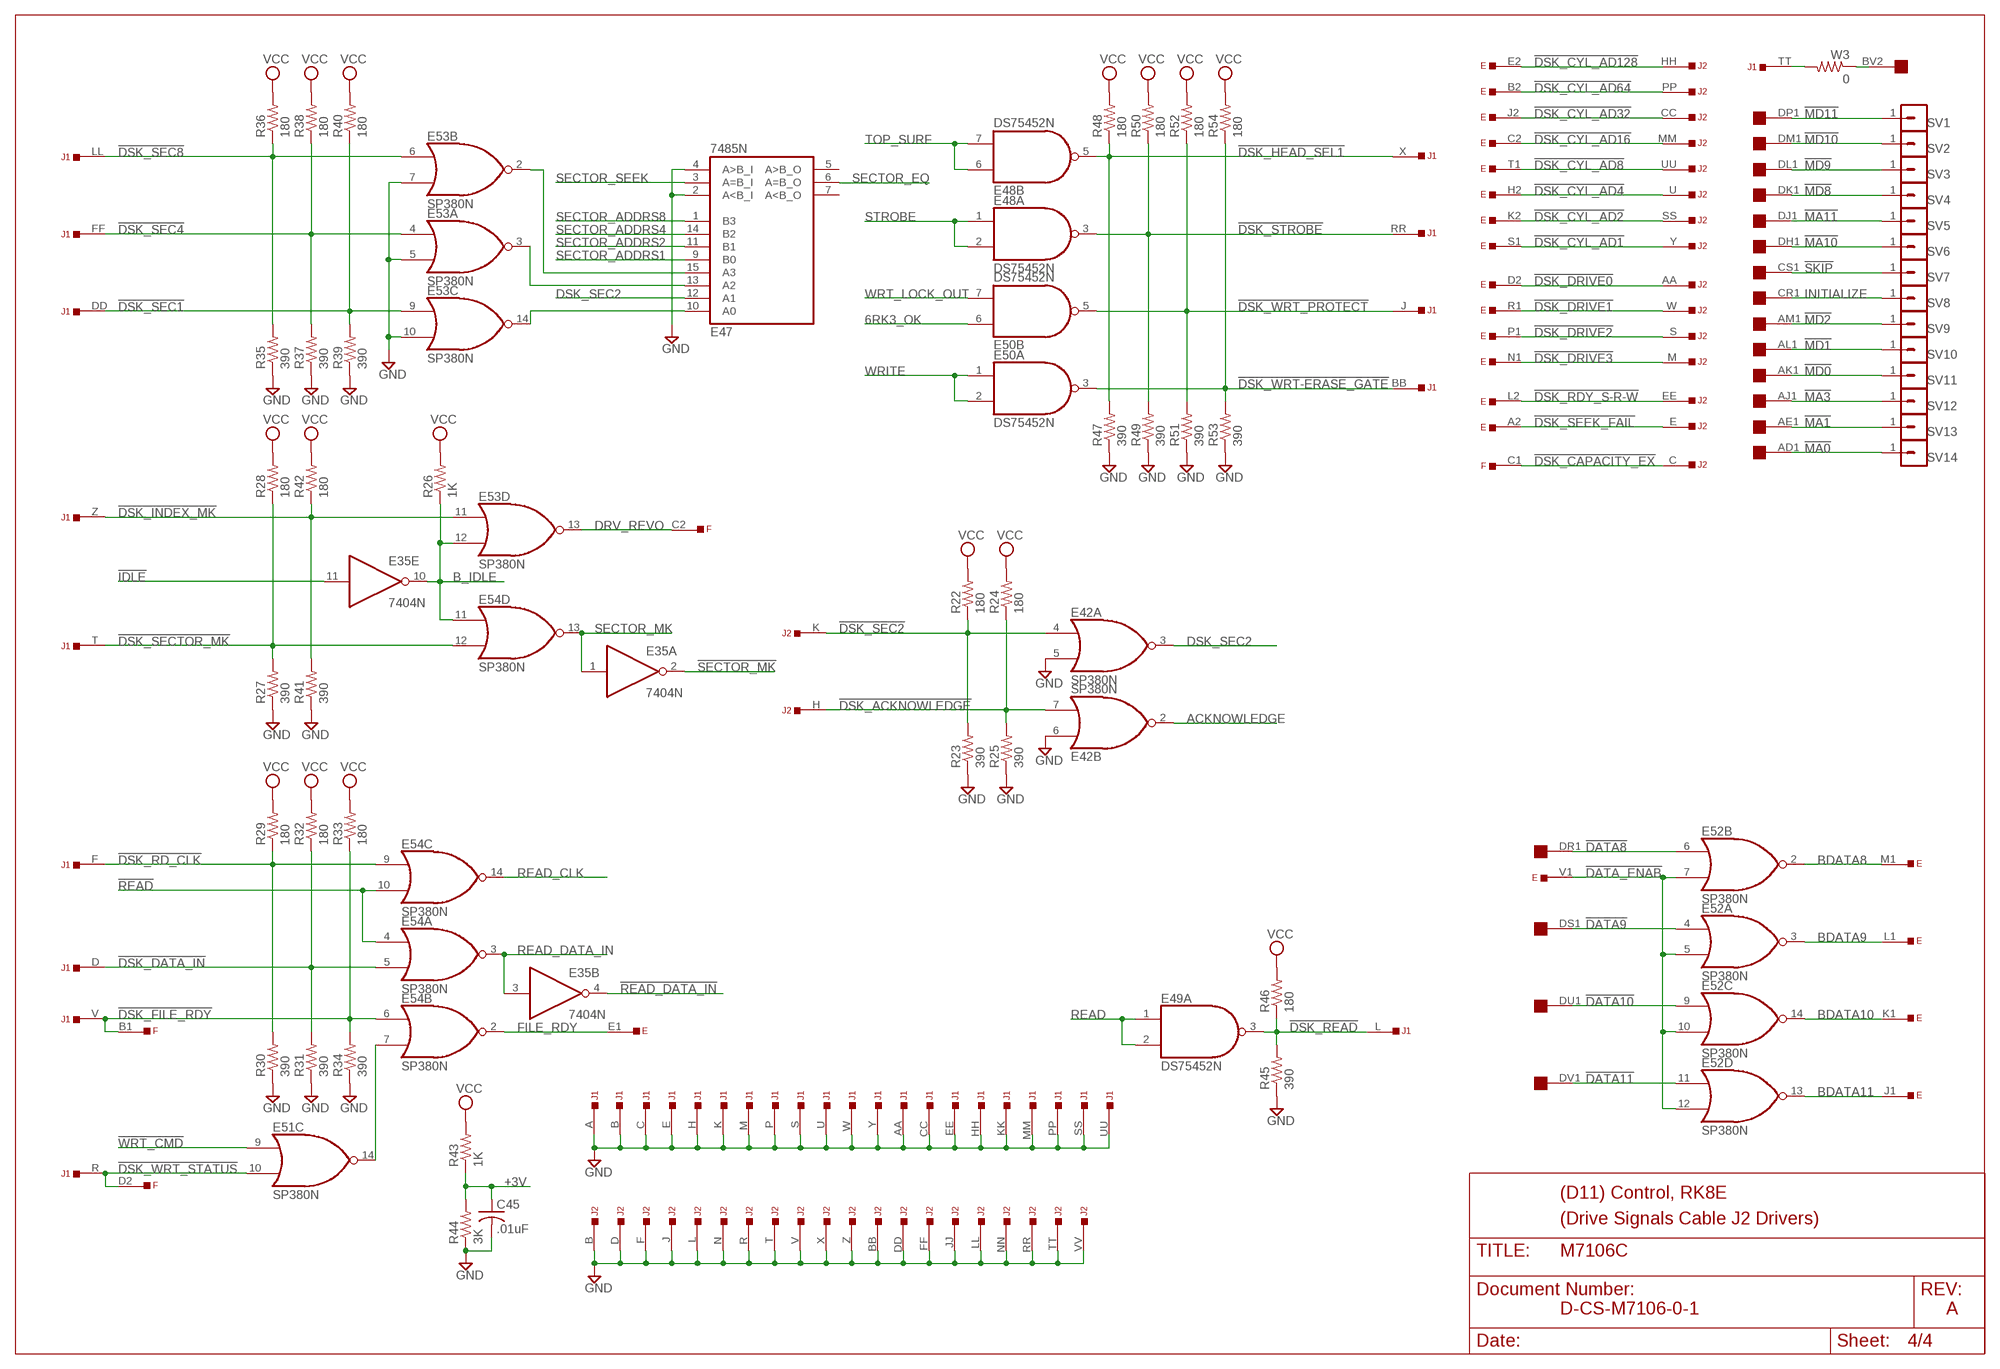
[diagram p3: schematic, sheet 4]

### Parts
C45  .01uF  C-US  [C063-025X075]
E42  SP380N  [DIL14]
E47  7485N  [DIL16]
E48  DS75452N  [DIL08]
E50  DS75452N  [DIL08]
E52  SP380N  [DIL14]
E53  SP380N  [DIL14]
E54  SP380N  [DIL14]
J1  DEC40PINSH  [DEC40PINH]
R22  180  R-US_0207/10  [0207/10]
R23  390  R-US_0207/10  [0207/10]
R24  180  R-US_0207/10  [0207/10]
R25  390  R-US_0207/10  [0207/10]
R26  1K  R-US_0207/10  [0207/10]
R27  390  R-US_0207/10  [0207/10]
R28  180  R-US_0207/10  [0207/10]
R29  180  R-US_0207/10  [0207/10]
R30  390  R-US_0207/10  [0207/10]
R31  390  R-US_0207/10  [0207/10]
R32  180  R-US_0207/10  [0207/10]
R33  180  R-US_0207/10  [0207/10]
R34  390  R-US_0207/10  [0207/10]
R35  390  R-US_0207/10  [0207/10]
R36  180  R-US_0207/10  [0207/10]
R37  390  R-US_0207/10  [0207/10]
R38  180  R-US_0207/10  [0207/10]
R39  390  R-US_0207/10  [0207/10]
R40  180  R-US_0207/10  [0207/10]
R41  390  R-US_0207/10  [0207/10]
R42  180  R-US_0207/10  [0207/10]
R43  1K  R-US_0207/10  [0207/10]
R44  3K  R-US_0207/10  [0207/10]
R45  390  R-US_0207/10  [0207/10]
R46  180  R-US_0207/10  [0207/10]
R47  390  R-US_0207/10  [0207/10]
R48  180  R-US_0207/10  [0207/10]
R49  390  R-US_0207/10  [0207/10]
R50  180  R-US_0207/10  [0207/10]
R51  390  R-US_0207/10  [0207/10]
R52  180  R-US_0207/10  [0207/10]
R53  390  R-US_0207/10  [0207/10]
R54  180  R-US_0207/10  [0207/10]
SV1  MA01-1  [MA01-1]
SV2  MA01-1  [MA01-1]
SV3  MA01-1  [MA01-1]
SV4  MA01-1  [MA01-1]
SV5  MA01-1  [MA01-1]
SV6  MA01-1  [MA01-1]
SV7  MA01-1  [MA01-1]
SV8  MA01-1  [MA01-1]
SV9  MA01-1  [MA01-1]
SV10  MA01-1  [MA01-1]
SV11  MA01-1  [MA01-1]
SV12  MA01-1  [MA01-1]
SV13  MA01-1  [MA01-1]
SV14  MA01-1  [MA01-1]
W3  0  R-US_0207/10  [0207/10]

### Nets
6RK3_OK: E50.6(B:I0) ; also sheet 1,3
!DATA8: E52.6(B:I0) OMNIBUS.DR1
!DATA9: E52.4(A:I0) OMNIBUS.DS1
!DATA10: E52.9(C:I0) OMNIBUS.DU1
!DATA11: E52.11(D:I0) OMNIBUS.DV1
!DATA_ENAB: E52.5(A:I1) E52.7(B:I1) E52.10(C:I1) E52.12(D:I1) E.V1
!DSK_ACKNOWLEDGE: E42.7(B:I1) J2.H R24.1 R25.2 ; also sheet 3
!DSK_CAPACITY_EX: F.C1 J2.C
!DSK_CYL_AD1: E.S1 J2.Y
!DSK_CYL_AD2: E.K2 J2.SS
!DSK_CYL_AD4: E.H2 J2.U
!DSK_CYL_AD8: E.T1 J2.UU
!DSK_CYL_AD16: E.C2 J2.MM
!DSK_CYL_AD32: E.J2 J2.CC
!DSK_CYL_AD64: E.B2 J2.PP
!DSK_CYL_AD128: E.E2 J2.HH
!DSK_DATA_IN: E54.5(A:I1) J1.D R31.2 R32.1
!DSK_DRIVE0: E.D2 J2.AA
!DSK_DRIVE1: E.R1 J2.W
!DSK_DRIVE2: E.P1 J2.S
!DSK_DRIVE3: E.N1 J2.M
!DSK_FILE_RDY: E54.6(B:I0) F.B1 J1.V R33.1 R34.2
!DSK_HEAD_SEL1: E48.5(B:O) J1.X R47.2 R48.1
!DSK_INDEX_MK: E53.11(D:I0) J1.Z R41.2 R42.1
!DSK_RD_CLK: E54.9(C:I0) J1.F R29.1 R30.2
!DSK_RDY_S-R-W: E.L2 J2.EE
!DSK_READ: E49.3(A:O) J1.L R45.2 R46.1
!DSK_SEC1: E53.9(C:I0) J1.DD R39.2 R40.1
!DSK_SEC2: E42.4(A:I0) J2.K R22.1 R23.2
!DSK_SEC4: E53.4(A:I0) J1.FF R37.2 R38.1
!DSK_SEC8: E53.6(B:I0) J1.LL R35.2 R36.1
!DSK_SECTOR_MK: E54.12(D:I1) J1.T R27.2 R28.1
!DSK_SEEK_FAIL: E.A2 J2.E
!DSK_STROBE: E48.3(A:O) J1.RR R49.2 R50.1
!DSK_WRT-ERASE_GATE: E50.3(A:O) J1.BB R53.2 R54.1
!DSK_WRT_PROTECT: E50.5(B:O) J1.J R51.2 R52.1
!DSK_WRT_STATUS: E51.10(C:I1) F.D2 J1.R
!IDLE: E35.11(E:I) ; also sheet 2,3
!MA0: OMNIBUS.AD1 SV14.1
!MA1: OMNIBUS.AE1 SV13.1
!MA3: OMNIBUS.AJ1 SV12.1
!MA10: OMNIBUS.DH1 SV6.1
!MA11: OMNIBUS.DJ1 SV5.1
!MD0: OMNIBUS.AK1 SV11.1
!MD1: OMNIBUS.AL1 SV10.1
!MD2: OMNIBUS.AM1 SV9.1
!MD8: OMNIBUS.DK1 SV4.1
!MD9: OMNIBUS.DL1 SV3.1
!MD10: OMNIBUS.DM1 SV2.1
!MD11: OMNIBUS.DP1 SV1.1
!READ: E54.4(A:I0) E54.10(C:I1) ; also sheet 2
!READ_DATA_IN: E35.4(B:O) ; also sheet 2
!SECTOR_MK: E35.2(A:O) ; also sheet 2,3
!SKIP: OMNIBUS.CS1 SV7.1
!WRT_CMD: E51.9(C:I0) ; also sheet 2,3
+3V: C45.1 R43.1 R44.2 ; also sheet 1,2,3
ACKNOWLEDGE: E42.2(B:O) ; also sheet 3
B_IDLE: E35.10(E:O) E53.12(D:I1) E54.11(D:I0) R26.1
BDATA8: E52.2(B:O) E.M1 ; also sheet 1
BDATA9: E52.3(A:O) E.L1 ; also sheet 1
BDATA10: E52.14(C:O) E.K1 ; also sheet 1
BDATA11: E52.13(D:O) E.J1 ; also sheet 1
DRV_REVO: E53.13(D:O) F.C2
DSK_SEC2: E42.3(A:O) E47.12(A1)
FILE_RDY: E54.2(B:O) E.E1 ; also sheet 3
GND [supply]: C45.2 E42.5(A:I1) E42.6(B:I0) E47.2(A<B_I) E47.4(A>B_I) E53.5(A:I1) E53.7(B:I1) E53.10(C:I1) J1.A J1.AA J1.B J1.C J1.CC J1.E J1.EE J1.H J1.HH J1.K J1.KK J1.M J1.MM J1.P J1.PP J1.S J1.SS J1.U J1.UU J1.W J1.Y J2.B J2.BB J2.D J2.DD J2.F J2.FF J2.J J2.JJ J2.L J2.LL J2.N J2.NN J2.R J2.RR J2.T J2.TT J2.V J2.VV J2.X J2.Z R23.1 R25.1 R27.1 R30.1 R31.1 R34.1 R35.1 R37.1 R39.1 R41.1 R44.1 R45.1 R47.1 R49.1 R51.1 R53.1 ; also sheet 1,2,3
INITIALIZE: OMNIBUS.CR1 SV8.1
J1TT: J1.TT W3.2
N$61: OMNIBUS.BV2 W3.1
N$82: E47.15(A3) E53.2(B:O)
N$83: E47.13(A2) E53.3(A:O)
N$84: E47.10(A0) E53.14(C:O)
N$85: E51.14(C:O) E54.7(B:I1)
READ: E49.1(A:I0) E49.2(A:I1) ; also sheet 1,2
READ_CLK: E54.14(C:O) ; also sheet 2
READ_DATA_IN: E35.3(B:I) E54.3(A:O)
SECTOR_ADDRS1: E47.9(B0) ; also sheet 1
SECTOR_ADDRS2: E47.11(B1) ; also sheet 1
SECTOR_ADDRS4: E47.14(B2) ; also sheet 1
SECTOR_ADDRS8: E47.1(B3) ; also sheet 1
SECTOR_EQ: E47.6(A=B_O) ; also sheet 3
SECTOR_MK: E35.1(A:I) E54.13(D:O) ; also sheet 2,3
SECTOR_SEEK: E47.3(A=B_I) ; also sheet 2,3
STROBE: E48.1(A:I0) E48.2(A:I1) ; also sheet 3
TOP_SURF: E48.6(B:I0) E48.7(B:I1) ; also sheet 1
VCC [supply]: R22.2 R24.2 R26.2 R28.2 R29.2 R32.2 R33.2 R36.2 R38.2 R40.2 R42.2 R43.2 R46.2 R48.2 R50.2 R52.2 R54.2 ; also sheet 1,2,3
WRITE: E50.1(A:I0) E50.2(A:I1) ; also sheet 2
WRT_LOCK_OUT: E50.7(B:I1) ; also sheet 1
Unconnected: E42.9(C:I0) E42.10(C:I1) E42.11(D:I0) E42.12(D:I1) E42.13(D:O) E42.14(C:O) E47.5(A>B_O) E47.7(A<B_O) J1.JJ J1.N J1.NN J1.VV

### Notes on the sheet
- (D11) Control, RK8E
- (Drive Signals Cable J2 Drivers)
- D-CS-M7106-0-1 | A

## Power pins joined to a net without a drawn wire
GND: E1.8(GND) E2.8(GND) E3.8(GND) E4.8(GND) E5.8(GND) E6.8(GND) E7.7(P:GND) E8.7(P:GND) E9.7(P:GND) E10.7(P:GND) E11.7(P:GND) E12.7(P:GND) E13.7(P:GND) E14.7(P:GND) E15.7(P:GND) E16.7(P:GND) E17.7(P:GND) E18.7(P:GND) E19.7(P:GND) E20.7(P:GND) E21.7(P:GND) E22.7(P:GND) E23.7(P:GND) E24.7(P:GND) E25.7(P:GND) E26.7(P:GND) E27.7(P:GND) E28.7(GND) E29.7(P:GND) E30.7(P:GND) E31.8(GND) E32.7(P:GND) E33.7(P:GND) E34.7(P:GND) E35.7(P:GND) E36.7(P:GND) E37.7(P:GND) E38.8(P:GND) E39.7(P:GND) E40.7(P:GND) E41.7(P:GND) E42.1(P:GND) E43.8(P:GND) E44.4(P:GND) E45.7(P:GND) E46.12(GND) E47.8(GND) E48.4(P:GND) E49.4(P:GND) E50.4(P:GND) E51.1(P:GND) E52.1(P:GND) E53.1(P:GND) E54.1(P:GND)
VCC: E1.16(VCC) E2.16(VCC) E3.16(VCC) E4.16(VCC) E5.16(VCC) E6.16(VCC) E7.14(P:VCC) E8.14(P:VCC) E9.14(P:VCC) E10.14(P:VCC) E11.14(P:VCC) E12.14(P:VCC) E13.14(P:VCC) E14.14(P:VCC) E15.14(P:VCC) E16.14(P:VCC) E17.14(P:VCC) E18.14(P:VCC) E19.14(P:VCC) E20.14(P:VCC) E21.14(P:VCC) E22.14(P:VCC) E23.14(P:VCC) E24.14(P:VCC) E25.14(P:VCC) E26.14(P:VCC) E27.14(P:VCC) E28.14(VCC) E29.14(P:VCC) E30.14(P:VCC) E31.16(VCC) E32.14(P:VCC) E33.14(P:VCC) E34.14(P:VCC) E35.14(P:VCC) E36.14(P:VCC) E37.14(P:VCC) E38.16(P:VCC) E39.14(P:VCC) E40.14(P:VCC) E41.14(P:VCC) E42.8(P:VCC) E43.16(P:VCC) E44.8(P:VCC) E45.14(P:VCC) E46.5(VCC) E47.16(VCC) E48.8(P:VCC) E49.8(P:VCC) E50.8(P:VCC) E51.8(P:VCC) E52.8(P:VCC) E53.8(P:VCC) E54.8(P:VCC)

## Library data of the parts
C1-C26 C30-C45 = dec-con:C-US: Capacitors with funky DEC lead spacing.
C27-C29 = dec-con:CPOL-USE20-8AXIAL: A 0.8 inch electrolytic.
CR1 = crystal:CRYSTAL: CRYSTAL; OC_FARNELL: unknown; OC_NEWARK: unknown
D3 = diode:DIODE-: DIODE
E F = dec-con:EDGE-TOP: Labeled DEC edge connector, suitable for top connector.
E1-E6 = dec-con:74*161: Synchronous 4-bit COUNTER
E7 E9 E11 E35 E36 = 74xx-us:74*04: Hex INVERTER
E8 E12 E14 E17 E25 E27 E33 E45 = 74xx-us:74*00: Quad 2-input NAND gate
E10 E34 E39 = 74xx-us:74*10: Triple 3-input NAND gate
E13 E23 E26 E29 E30 E40 = 74xx-us:74*02: Quad 2-input NOR gate
E15 E18-E22 E24 E37 E41 = 74xx-us:74*74: Dual D type positive edge triggered FLIP FLOP, preset and clear
E16 E32 = 74xx-us:74*08: Quad 2-input AND gate
E28 = dec-con:74*52: Expandable 2-2-2-3 Input AND-OR gate.
E31 = 74xx-us:74*155: Dual 2-line to 4-line data DECODER/DEMULTIPLEXER
E38 E43 = 74xx-us:74*123: Retriggerable monostable MULTIVIBRATOR
E42 E51-E54 = dec-con:SP380: Quad NOR gate (use 8640)
E44 E48-E50 = dec-con:DS75452: Quad 2-input NAND gate, open collector output
E46 = 74xx-us:74*96: 5-bit SHIFT REGISTER
E47 = 74xx-us:74*85: 4-bit magnitude COMPARATOR
J1 J2 = dec-con:DEC40PINS: 40 pin ribbon connector for BC08, BC11 cables.
OMNIBUS = dec-con:QUAD: Quad-Height DEC board
R1-R3 R5-R11 R13-R55 W1-W3 = rcl:R-US_: RESISTOR, American symbol
R4 R12 = dec-con:275P: Trimpot with 275P (3006Y) footprint.
SV1-SV14 = dec-con:MA01-1: Pin Header (.125" spacing)
TP1-TP3 = dec-con:PAD: WIRE PAD Standard US Drill Sizes

## Net classes
1 supply: width 0.813 mm